# EAGLE board electrotactile_extension (EAGLE 9.4.0), part 1 of 2
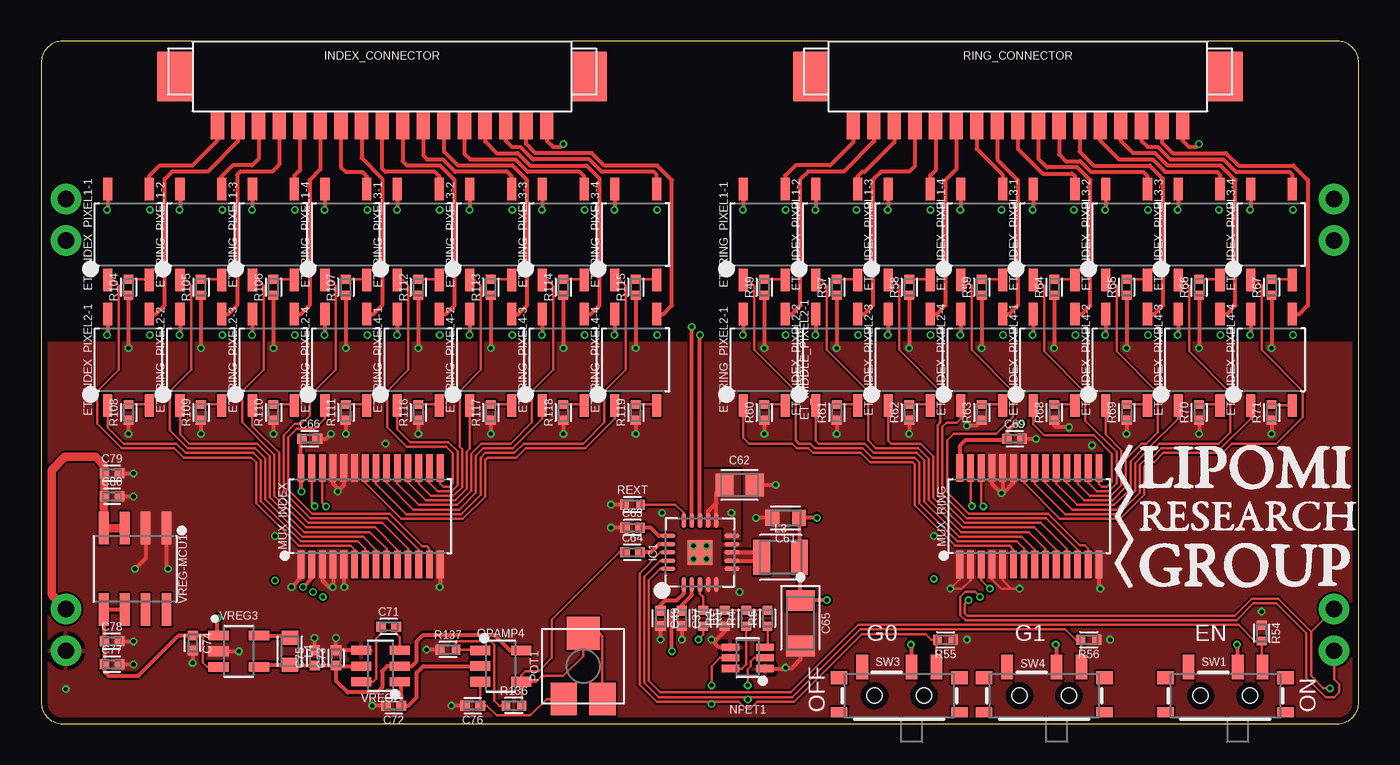
[diagram p6: board, top side]
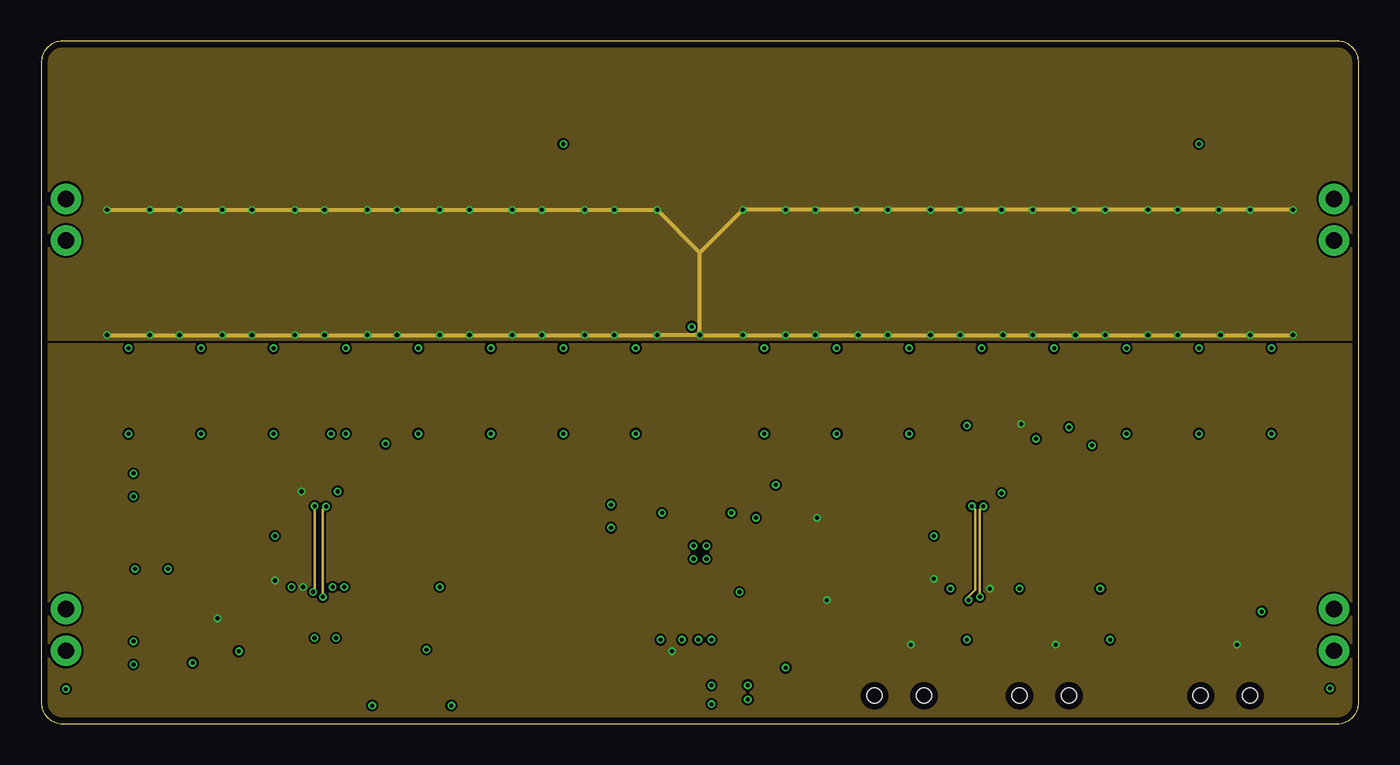
[diagram p7: board, inner layer Route2]
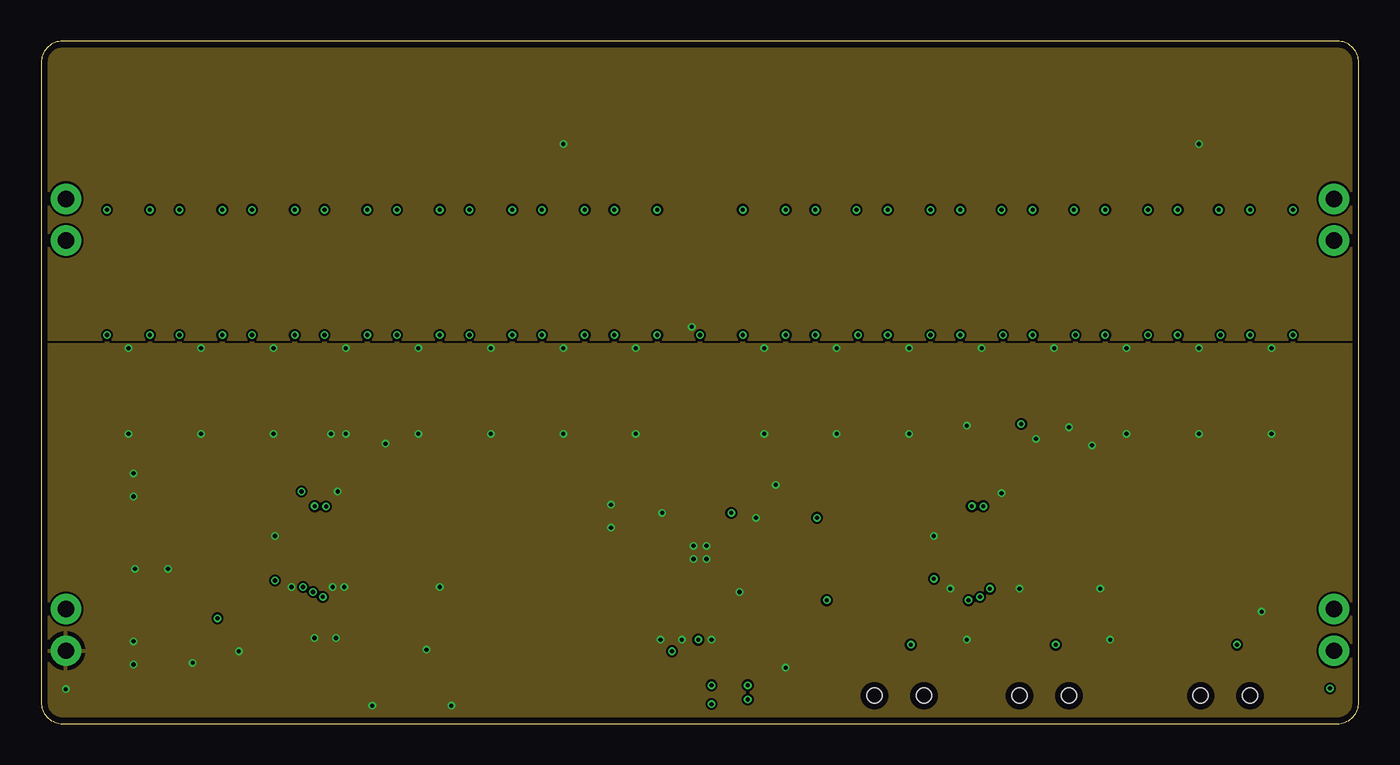
[diagram p8: board, inner layer Route15]
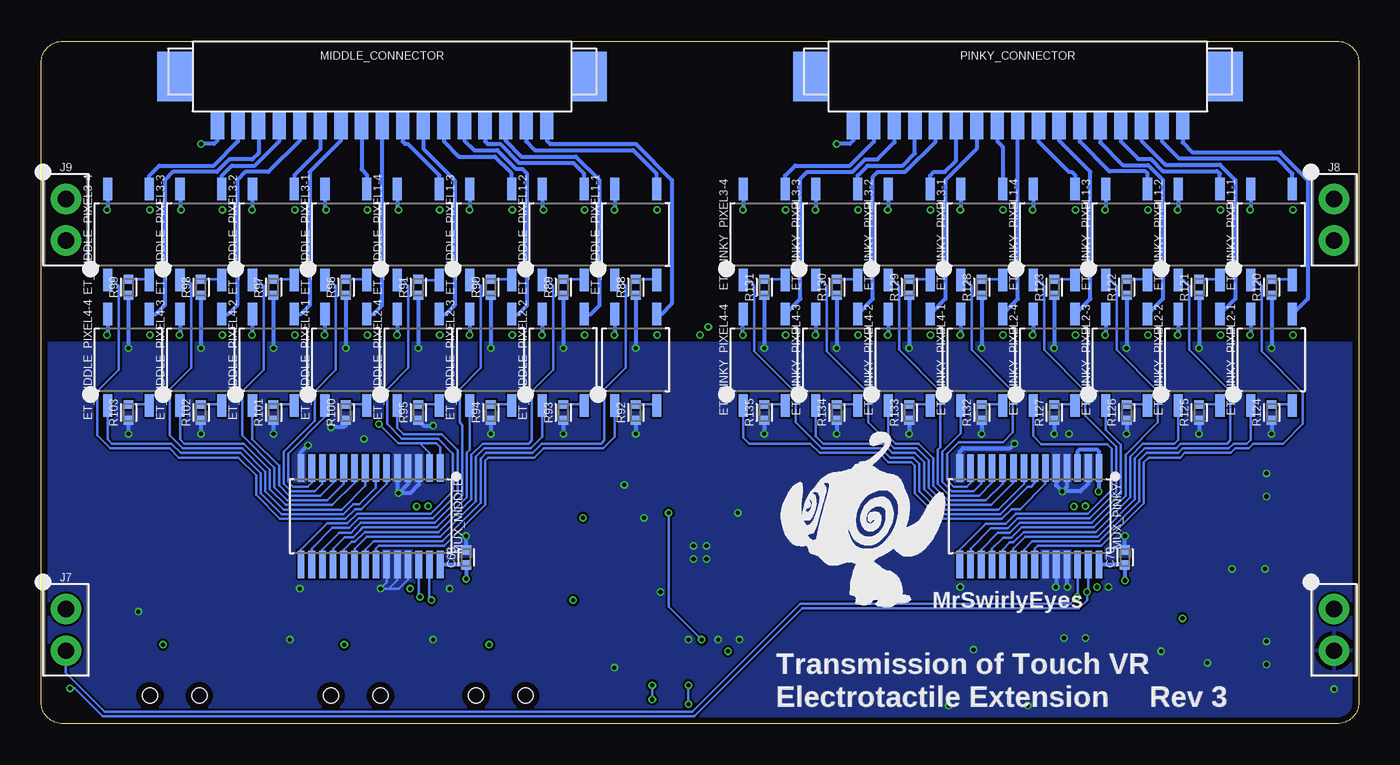
[diagram p9: board, bottom side, seen from below]

Size 80 x 41.44 mm. Coordinates in mm from the lower left corner, seen from the top.
Outline: 78.7,41.44 1.3,41.44 arc90 0,40.14 0,1.3 arc90 1.3,0 78.7,0 arc90 80,1.3 80,40.14 arc90 78.7,41.44
Copper layers (1*2*15*16): Top 0.035559375mm / dielectric 0.17018125mm / Route2 0.01778125mm / dielectric 47mil / Route15 0.01778125mm / dielectric 0.17018125mm / Bottom 0.035559375mm
Design rules "oshpark-4layer": minimum track width 5mil, minimum drill 10mil, track to track 5mil, track to pad 5mil, pad to pad 5mil, via to via 5mil, smd to smd 5mil, copper to edge 15mil, drill to drill 6mil, minimum pad ring 4mil, minimum via ring 4mil, stop-mask expansion 2.5mil, vias tented up to drill 0mil, thermal gap 10mil
Net classes: 1 vcc: width 0.152 mm, drill 0.152 mm, clearance 0.152 mm; 2 RFSIG: width 0.152 mm; 3 ASIG: width 0.152 mm; 4 DGND: width 0.152 mm; 5 NGND: width 0.152 mm

## Footprints (pad centres in the part's own frame; a part is rotated, then mirrored left to right if it is on the bottom)
CAPC1005X55_SMD-0402 = smd 0.585 x 0.612: 1 -0.458,0; 2 0.458,0
CAPC1608X95 = smd 0.846 x 0.97: 1 -0.812,0; 2 0.812,0
CAPC2012X95_SMD-0805 = smd 1.065 x 1.379: 1 -0.925,0; 2 0.925,0
CAPCP3216X160 = smd 1.262 x 1.712: A -1.375,0; K 1.375,0
SOP254P609X203-4 = smd 1.371 x 0.553: 1 -2.768,1.27; 2 -2.768,-1.27; 3 2.768,-1.27; 4 2.768,1.27
QFN50P400X400X100-21T270 = smd 0.896 x 0.264: 1 -1.937,1; 2 -1.937,0.5; 3 -1.937,0; 4 -1.937,-0.5; 5 -1.937,-1; 11 1.937,-1; 12 1.937,-0.5; 13 1.937,0; 14 1.937,0.5; 15 1.937,1 | smd 0.264 x 0.896: 6 -1,-1.937; 7 -0.5,-1.937; 8 0,-1.937; 9 0.5,-1.937; 10 1,-1.937; 16 1,1.937; 17 0.5,1.937; 18 0,1.937; 19 -0.5,1.937; 20 -1,1.937 | smd 1.5 x 1.5: EP 0,0 | drill 0.254 pad 0.381: P$1 -0.4,0.4; P$2 0.4,0.4; P$3 0.4,-0.4; P$4 -0.4,-0.4
1X17_MOLEX_0532611771_RA_SMD = smd 0.8 x 1.6: 1 -10,-3; 2 -8.75,-3; 3 -7.5,-3; 4 -6.25,-3; 5 -5,-3; 6 -3.75,-3; 7 -2.5,-3; 8 -1.25,-3; 9 0,-3; 10 1.25,-3; 11 2.5,-3; 12 3.75,-3; 13 5,-3; 14 6.25,-3; 15 7.5,-3; 16 8.75,-3; 17 10,-3 | smd 2.1 x 3: P$1 -12.6,0; P$2 12.6,0
HDRVR2W64P254_1X2_558X254X850B = drill 1 pad 1.85: 1 -1.27,0; 2 1.27,0
INDC2520X100 = smd 1.012 x 2.112: 1 -1.15,0; 2 1.15,0
INDC1608X60-0603 = smd 0.859 x 1.015: 1 -0.828,0; 2 0.828,0
SOP65P650X110-28 = smd 1.659 x 0.407: 1 -2.926,4.225; 2 -2.926,3.575; 3 -2.926,2.925; 4 -2.926,2.275; 5 -2.926,1.625; 6 -2.926,0.975; 7 -2.926,0.325; 8 -2.926,-0.325; 9 -2.926,-0.975; 10 -2.926,-1.625; 11 -2.926,-2.275; 12 -2.926,-2.925; 13 -2.926,-3.575; 14 -2.926,-4.225; 15 2.926,-4.225; 16 2.926,-3.575; 17 2.926,-2.925; 18 2.926,-2.275; 19 2.926,-1.625; 20 2.926,-0.975; 21 2.926,-0.325; 22 2.926,0.325; 23 2.926,0.975; 24 2.926,1.625; 25 2.926,2.275; 26 2.926,2.925; 27 2.926,3.575; 28 2.926,4.225
SOT65P230X110-6 = smd 1.056 x 0.439: 1 -1.057,0.65; 2 -1.057,0; 3 -1.057,-0.65; 4 1.057,-0.65; 5 1.057,0; 6 1.057,0.65
SOT95P280X145-5 = smd 1.209 x 0.589: 1 -1.253,0.95; 2 -1.253,0; 3 -1.253,-0.95; 4 1.253,-0.95; 5 1.253,0.95
POTENTIOMETER_SQ-L5-W4.5-H2.3 = smd 1.6 x 2: 1 1.175,-2; 3 -1.175,-2 | smd 2 x 2: 2 0,2
RESC1005X35_SMD-0402 = smd 0.535 x 0.6: 1 -0.482,0; 2 0.482,0
SW_SLIDE_SPDT_RA_SMD_4V_300MA_6.7L-2.6W = smd 1.5 x 0.7: 1 1.75,2.25; 2 1.75,-0.75; 3 1.75,-2.25 | smd 0.6 x 1: NC1 -1,-3.65; NC3 -1,3.65 | smd 0.8 x 1: NC2 1.1,-3.65; NC4 1.1,3.65 | hole 0.9: 0,-1.5; 0,1.5
SOT95P275X100-6 = smd 1.212 x 0.552: 1 -1.175,0.95; 2 -1.175,0; 3 -1.175,-0.95; 4 1.175,-0.95; 5 1.175,0; 6 1.175,0.95
SOT95P280X145-5' = smd 1.253 x 0.589: 1 -1.231,0.95; 2 -1.231,0; 3 -1.231,-0.95; 4 1.231,-0.95; 5 1.231,0.95
SOIC127P600X265-8 = smd 1.968 x 0.599: 1 -2.473,1.905; 2 -2.473,0.635; 3 -2.473,-0.635; 4 -2.473,-1.905; 5 2.473,-1.905; 6 2.473,-0.635; 7 2.473,0.635; 8 2.473,1.905

## Placement (x,y rotation side)
C37  0.1uF/50V  [CAPC1005X55_SMD-0402]  38.9,6.4 270 top
C49  0.1uF/50V  [CAPC1005X55_SMD-0402]  37.6,6.4 270 top
C61  0.1uF/50V  [CAPC1608X95]  45.2,12.5 180 top
C62  0.1uF/250V/0805  [CAPC2012X95_SMD-0805]  42.4,14.5 0 top
C63  0.1uF/50V  [CAPC1005X55_SMD-0402]  35.9,11.9 0 top
C64  0.1uF/50V  [CAPC1005X55_SMD-0402]  35.9,10.4 0 top
C65  100uF/10V  [CAPCP3216X160]  46.1,6.1 270 top
C66  0.1uF/50V  [CAPC1005X55_SMD-0402]  16.3,17.3 0 top
C68  0.1uF/50V  [CAPC1005X55_SMD-0402]  54.2,10.1 90 bottom
C69  0.1uF/50V  [CAPC1005X55_SMD-0402]  59.1,17.3 0 top
C70  0.1uF/50V  [CAPC1005X55_SMD-0402]  14.2,10.1 90 bottom
C71  10uF/6.3V  [CAPC1005X55_SMD-0402]  21.1,5.9 0 top
C72  10uF/6.3V  [CAPC1005X55_SMD-0402]  21.4,1.1 180 top
C73  10uF/6.3V  [CAPC1005X55_SMD-0402]  17.9,4 90 top
C74  4.7uF/10V/0402  [CAPC1005X55_SMD-0402]  9.2,4.9 270 top
C75  10uF/6.3V  [CAPC1005X55_SMD-0402]  16.6,4 90 top
C76  0.1uF/50V  [CAPC1005X55_SMD-0402]  26.2,1.1 180 top
C77  10uF/6.3V  [CAPC1005X55_SMD-0402]  4.3,3.6 0 top
C78  0.1uF/50V  [CAPC1005X55_SMD-0402]  4.3,5 0 top
C79  10uF/6.3V  [CAPC1005X55_SMD-0402]  4.3,15.2 0 top
C80  0.1uF/50V  [CAPC1005X55_SMD-0402]  4.3,13.8 0 top
ET_INDEX_PIXEL1-1  SPST-NO 170mA 250V  [SOP254P609X203-4]  5.3,29.7 90 top
ET_INDEX_PIXEL1-2  SPST-NO 170mA 250V  [SOP254P609X203-4]  9.7,29.7 90 top
ET_INDEX_PIXEL1-3  SPST-NO 170mA 250V  [SOP254P609X203-4]  14.1,29.7 90 top
ET_INDEX_PIXEL1-4  SPST-NO 170mA 250V  [SOP254P609X203-4]  18.5,29.7 90 top
ET_INDEX_PIXEL2-1  SPST-NO 170mA 250V  [SOP254P609X203-4]  5.3,22.1 90 top
ET_INDEX_PIXEL2-2  SPST-NO 170mA 250V  [SOP254P609X203-4]  9.7,22.1 90 top
ET_INDEX_PIXEL2-3  SPST-NO 170mA 250V  [SOP254P609X203-4]  14.1,22.1 90 top
ET_INDEX_PIXEL2-4  SPST-NO 170mA 250V  [SOP254P609X203-4]  18.5,22.1 90 top
ET_INDEX_PIXEL3-1  SPST-NO 170mA 250V  [SOP254P609X203-4]  22.9,29.7 90 top
ET_INDEX_PIXEL3-2  SPST-NO 170mA 250V  [SOP254P609X203-4]  27.3,29.7 90 top
ET_INDEX_PIXEL3-3  SPST-NO 170mA 250V  [SOP254P609X203-4]  31.7,29.7 90 top
ET_INDEX_PIXEL3-4  SPST-NO 170mA 250V  [SOP254P609X203-4]  36.1,29.7 90 top
ET_INDEX_PIXEL4-1  SPST-NO 170mA 250V  [SOP254P609X203-4]  22.9,22.1 90 top
ET_INDEX_PIXEL4-2  SPST-NO 170mA 250V  [SOP254P609X203-4]  27.3,22.1 90 top
ET_INDEX_PIXEL4-3  SPST-NO 170mA 250V  [SOP254P609X203-4]  31.7,22.1 90 top
ET_INDEX_PIXEL4-4  SPST-NO 170mA 250V  [SOP254P609X203-4]  36.1,22.1 90 top
ET_MIDDLE_PIXEL1-1  SPST-NO 170mA 250V  [SOP254P609X203-4]  43.9,29.7 90 bottom
ET_MIDDLE_PIXEL1-2  SPST-NO 170mA 250V  [SOP254P609X203-4]  48.3,29.7 90 bottom
ET_MIDDLE_PIXEL1-3  SPST-NO 170mA 250V  [SOP254P609X203-4]  52.7,29.7 90 bottom
ET_MIDDLE_PIXEL1-4  SPST-NO 170mA 250V  [SOP254P609X203-4]  57.1,29.7 90 bottom
ET_MIDDLE_PIXEL2-1  SPST-NO 170mA 250V  [SOP254P609X203-4]  43.9,22.1 90 bottom
ET_MIDDLE_PIXEL2-2  SPST-NO 170mA 250V  [SOP254P609X203-4]  48.3,22.1 90 bottom
ET_MIDDLE_PIXEL2-3  SPST-NO 170mA 250V  [SOP254P609X203-4]  52.7,22.1 90 bottom
ET_MIDDLE_PIXEL2-4  SPST-NO 170mA 250V  [SOP254P609X203-4]  57.1,22.1 90 bottom
ET_MIDDLE_PIXEL3-1  SPST-NO 170mA 250V  [SOP254P609X203-4]  61.5,29.7 90 bottom
ET_MIDDLE_PIXEL3-2  SPST-NO 170mA 250V  [SOP254P609X203-4]  65.9,29.7 90 bottom
ET_MIDDLE_PIXEL3-3  SPST-NO 170mA 250V  [SOP254P609X203-4]  70.3,29.7 90 bottom
ET_MIDDLE_PIXEL3-4  SPST-NO 170mA 250V  [SOP254P609X203-4]  74.7,29.7 90 bottom
ET_MIDDLE_PIXEL4-1  SPST-NO 170mA 250V  [SOP254P609X203-4]  61.5,22.1 90 bottom
ET_MIDDLE_PIXEL4-2  SPST-NO 170mA 250V  [SOP254P609X203-4]  65.9,22.1 90 bottom
ET_MIDDLE_PIXEL4-3  SPST-NO 170mA 250V  [SOP254P609X203-4]  70.3,22.1 90 bottom
ET_MIDDLE_PIXEL4-4  SPST-NO 170mA 250V  [SOP254P609X203-4]  74.7,22.1 90 bottom
ET_PINKY_PIXEL1-1  SPST-NO 170mA 250V  [SOP254P609X203-4]  5.3,29.7 90 bottom
ET_PINKY_PIXEL1-2  SPST-NO 170mA 250V  [SOP254P609X203-4]  9.7,29.7 90 bottom
ET_PINKY_PIXEL1-3  SPST-NO 170mA 250V  [SOP254P609X203-4]  14.1,29.7 90 bottom
ET_PINKY_PIXEL1-4  SPST-NO 170mA 250V  [SOP254P609X203-4]  18.5,29.7 90 bottom
ET_PINKY_PIXEL2-1  SPST-NO 170mA 250V  [SOP254P609X203-4]  5.3,22.1 90 bottom
ET_PINKY_PIXEL2-2  SPST-NO 170mA 250V  [SOP254P609X203-4]  9.7,22.1 90 bottom
ET_PINKY_PIXEL2-3  SPST-NO 170mA 250V  [SOP254P609X203-4]  14.1,22.1 90 bottom
ET_PINKY_PIXEL2-4  SPST-NO 170mA 250V  [SOP254P609X203-4]  18.5,22.1 90 bottom
ET_PINKY_PIXEL3-1  SPST-NO 170mA 250V  [SOP254P609X203-4]  22.9,29.7 90 bottom
ET_PINKY_PIXEL3-2  SPST-NO 170mA 250V  [SOP254P609X203-4]  27.3,29.7 90 bottom
ET_PINKY_PIXEL3-3  SPST-NO 170mA 250V  [SOP254P609X203-4]  31.7,29.7 90 bottom
ET_PINKY_PIXEL3-4  SPST-NO 170mA 250V  [SOP254P609X203-4]  36.1,29.7 90 bottom
ET_PINKY_PIXEL4-1  SPST-NO 170mA 250V  [SOP254P609X203-4]  22.9,22.1 90 bottom
ET_PINKY_PIXEL4-2  SPST-NO 170mA 250V  [SOP254P609X203-4]  27.3,22.1 90 bottom
ET_PINKY_PIXEL4-3  SPST-NO 170mA 250V  [SOP254P609X203-4]  31.7,22.1 90 bottom
ET_PINKY_PIXEL4-4  SPST-NO 170mA 250V  [SOP254P609X203-4]  36.1,22.1 90 bottom
ET_RING_PIXEL1-1  SPST-NO 170mA 250V  [SOP254P609X203-4]  43.9,29.7 90 top
ET_RING_PIXEL1-2  SPST-NO 170mA 250V  [SOP254P609X203-4]  48.3,29.7 90 top
ET_RING_PIXEL1-3  SPST-NO 170mA 250V  [SOP254P609X203-4]  52.7,29.7 90 top
ET_RING_PIXEL1-4  SPST-NO 170mA 250V  [SOP254P609X203-4]  57.1,29.7 90 top
ET_RING_PIXEL2-1  SPST-NO 170mA 250V  [SOP254P609X203-4]  43.9,22.1 90 top
ET_RING_PIXEL2-2  SPST-NO 170mA 250V  [SOP254P609X203-4]  48.3,22.1 90 top
ET_RING_PIXEL2-3  SPST-NO 170mA 250V  [SOP254P609X203-4]  52.7,22.1 90 top
ET_RING_PIXEL2-4  SPST-NO 170mA 250V  [SOP254P609X203-4]  57.1,22.1 90 top
ET_RING_PIXEL3-1  SPST-NO 170mA 250V  [SOP254P609X203-4]  61.5,29.7 90 top
ET_RING_PIXEL3-2  SPST-NO 170mA 250V  [SOP254P609X203-4]  65.9,29.7 90 top
ET_RING_PIXEL3-3  SPST-NO 170mA 250V  [SOP254P609X203-4]  70.3,29.7 90 top
ET_RING_PIXEL3-4  SPST-NO 170mA 250V  [SOP254P609X203-4]  74.7,29.7 90 top
ET_RING_PIXEL4-1  SPST-NO 170mA 250V  [SOP254P609X203-4]  61.5,22.1 90 top
ET_RING_PIXEL4-2  SPST-NO 170mA 250V  [SOP254P609X203-4]  65.9,22.1 90 top
ET_RING_PIXEL4-3  SPST-NO 170mA 250V  [SOP254P609X203-4]  70.3,22.1 90 top
ET_RING_PIXEL4-4  SPST-NO 170mA 250V  [SOP254P609X203-4]  74.7,22.1 90 top
IC1  DRV8662  [QFN50P400X400X100-21T270]  40,10.4 90 top
INDEX_CONNECTOR  1x17 MOLEX SMD RA  [1X17_MOLEX_0532611771_RA_SMD]  20.7,39.3 0 top
J6  1x02 PTH VERT FEMALE  [HDRVR2W64P254_1X2_558X254X850B]  1.5,5.7 270 bottom
J7  1x02 PTH VERT FEMALE  [HDRVR2W64P254_1X2_558X254X850B]  78.5,5.7 270 bottom
J8  1x02 PTH VERT FEMALE  [HDRVR2W64P254_1X2_558X254X850B]  1.5,30.6 270 bottom
J9  1x02 PTH VERT FEMALE  [HDRVR2W64P254_1X2_558X254X850B]  78.5,30.6 270 bottom
L3  4.7uH/2A/1008  [INDC2520X100]  44.9,10.1 0 top
L4  10uH/380mA  [INDC1608X60-0603]  15.1,4.4 270 top
MIDDLE_CONNECTOR  1x17 MOLEX SMD RA  [1X17_MOLEX_0532611771_RA_SMD]  59.3,39.3 0 bottom
MUX_INDEX  PCA9685  [SOP65P650X110-28]  20,12.6 90 top
MUX_MIDDLE  PCA9685  [SOP65P650X110-28]  60,12.6 270 bottom
MUX_PINKY  PCA9685  [SOP65P650X110-28]  20,12.6 270 bottom
MUX_RING  PCA9685  [SOP65P650X110-28]  60,12.6 90 top
NFET1  2N7002DW  [SOT65P230X110-6]  42.9,4 180 top
OPAMP4  TLV2361_GP_20MA_7MHZ  [SOT95P280X145-5]  27.9,3.5 0 top
PINKY_CONNECTOR  1x17 MOLEX SMD RA  [1X17_MOLEX_0532611771_RA_SMD]  20.7,39.3 0 bottom
POT1  100K  [POTENTIOMETER_SQ-L5-W4.5-H2.3]  32.9,3.5 0 top
R1  768K  [RESC1005X35_SMD-0402]  40.2,6.4 270 top
R2  115K  [RESC1005X35_SMD-0402]  41.5,6.4 90 top
R4  220K  [RESC1005X35_SMD-0402]  42.8,6.4 90 top
R5  100K  [RESC1005X35_SMD-0402]  44.1,6.4 90 top
R49  1K  [RESC1005X35_SMD-0402]  5.3,26.5 90 top
R54  10K  [RESC1005X35_SMD-0402]  74.1,5.5 270 top
R55  10K  [RESC1005X35_SMD-0402]  54.9,5.1 180 top
R56  10K  [RESC1005X35_SMD-0402]  63.6,5.1 180 top
R57  1K  [RESC1005X35_SMD-0402]  9.7,26.5 90 top
R58  1K  [RESC1005X35_SMD-0402]  14.1,26.5 90 top
R59  1K  [RESC1005X35_SMD-0402]  18.5,26.5 90 top
R60  1K  [RESC1005X35_SMD-0402]  5.3,18.9 90 top
R61  1K  [RESC1005X35_SMD-0402]  9.7,18.9 90 top
R62  1K  [RESC1005X35_SMD-0402]  14.1,18.9 90 top
R63  1K  [RESC1005X35_SMD-0402]  18.5,18.9 90 top
R64  1K  [RESC1005X35_SMD-0402]  22.9,26.5 90 top
R65  1K  [RESC1005X35_SMD-0402]  27.3,26.5 90 top
R66  1K  [RESC1005X35_SMD-0402]  31.7,26.5 90 top
R67  1K  [RESC1005X35_SMD-0402]  36.1,26.5 90 top
R68  1K  [RESC1005X35_SMD-0402]  22.9,18.9 90 top
R69  1K  [RESC1005X35_SMD-0402]  27.3,18.9 90 top
R70  1K  [RESC1005X35_SMD-0402]  31.7,18.9 90 top
R71  1K  [RESC1005X35_SMD-0402]  36.1,18.9 90 top
R88  1K  [RESC1005X35_SMD-0402]  43.9,26.5 90 bottom
R89  1K  [RESC1005X35_SMD-0402]  48.3,26.5 90 bottom
R90  1K  [RESC1005X35_SMD-0402]  52.7,26.5 90 bottom
R91  1K  [RESC1005X35_SMD-0402]  57.1,26.5 90 bottom
R92  1K  [RESC1005X35_SMD-0402]  43.9,18.9 90 bottom
R93  1K  [RESC1005X35_SMD-0402]  48.3,18.9 90 bottom
R94  1K  [RESC1005X35_SMD-0402]  52.7,18.9 90 bottom
R95  1K  [RESC1005X35_SMD-0402]  57.1,18.9 90 bottom
R96  1K  [RESC1005X35_SMD-0402]  61.5,26.5 90 bottom
R97  1K  [RESC1005X35_SMD-0402]  65.9,26.5 90 bottom
R98  1K  [RESC1005X35_SMD-0402]  70.3,26.5 90 bottom
R99  1K  [RESC1005X35_SMD-0402]  74.7,26.5 90 bottom
R100  1K  [RESC1005X35_SMD-0402]  61.5,18.9 90 bottom
R101  1K  [RESC1005X35_SMD-0402]  65.9,18.9 90 bottom
R102  1K  [RESC1005X35_SMD-0402]  70.3,18.9 90 bottom
R103  1K  [RESC1005X35_SMD-0402]  74.7,18.9 90 bottom
R104  1K  [RESC1005X35_SMD-0402]  43.9,26.5 90 top
R105  1K  [RESC1005X35_SMD-0402]  48.3,26.5 90 top
R106  1K  [RESC1005X35_SMD-0402]  52.7,26.5 90 top
R107  1K  [RESC1005X35_SMD-0402]  57.1,26.5 90 top
R108  1K  [RESC1005X35_SMD-0402]  43.9,18.9 90 top
R109  1K  [RESC1005X35_SMD-0402]  48.3,18.9 90 top
R110  1K  [RESC1005X35_SMD-0402]  52.7,18.9 90 top
R111  1K  [RESC1005X35_SMD-0402]  57.1,18.9 90 top
R112  1K  [RESC1005X35_SMD-0402]  61.5,26.5 90 top
R113  1K  [RESC1005X35_SMD-0402]  65.9,26.5 90 top
R114  1K  [RESC1005X35_SMD-0402]  70.3,26.5 90 top
R115  1K  [RESC1005X35_SMD-0402]  74.7,26.5 90 top
R116  1K  [RESC1005X35_SMD-0402]  61.5,18.9 90 top
R117  1K  [RESC1005X35_SMD-0402]  65.9,18.9 90 top
R118  1K  [RESC1005X35_SMD-0402]  70.3,18.9 90 top
R119  1K  [RESC1005X35_SMD-0402]  74.7,18.9 90 top
R120  1K  [RESC1005X35_SMD-0402]  5.3,26.5 90 bottom
R121  1K  [RESC1005X35_SMD-0402]  9.7,26.5 90 bottom
R122  1K  [RESC1005X35_SMD-0402]  14.1,26.5 90 bottom
R123  1K  [RESC1005X35_SMD-0402]  18.5,26.5 90 bottom
R124  1K  [RESC1005X35_SMD-0402]  5.3,18.9 90 bottom
R125  1K  [RESC1005X35_SMD-0402]  9.7,18.9 90 bottom
R126  1K  [RESC1005X35_SMD-0402]  14.1,18.9 90 bottom
R127  1K  [RESC1005X35_SMD-0402]  18.5,18.9 90 bottom
R128  1K  [RESC1005X35_SMD-0402]  22.9,26.5 90 bottom
R129  1K  [RESC1005X35_SMD-0402]  27.3,26.5 90 bottom
R130  1K  [RESC1005X35_SMD-0402]  31.7,26.5 90 bottom
R131  1K  [RESC1005X35_SMD-0402]  36.1,26.5 90 bottom
R132  1K  [RESC1005X35_SMD-0402]  22.9,18.9 90 bottom
R133  1K  [RESC1005X35_SMD-0402]  27.3,18.9 90 bottom
R134  1K  [RESC1005X35_SMD-0402]  31.7,18.9 90 bottom
R135  1K  [RESC1005X35_SMD-0402]  36.1,18.9 90 bottom
R136  10K  [RESC1005X35_SMD-0402]  28.7,1.1 0 top
R137  10K  [RESC1005X35_SMD-0402]  24.7,4.5 0 top
REXT  7.5K  [RESC1005X35_SMD-0402]  35.9,13.3 0 top
RING_CONNECTOR  1x17 MOLEX SMD RA  [1X17_MOLEX_0532611771_RA_SMD]  59.3,39.3 0 top
SW1  300mA/4V  [SW_SLIDE_SPDT_RA_SMD_4V_300MA_6.7L-2.6W]  71.9,1.7 90 top
SW3  300mA/4V  [SW_SLIDE_SPDT_RA_SMD_4V_300MA_6.7L-2.6W]  52.1,1.7 90 top
SW4  300mA/4V  [SW_SLIDE_SPDT_RA_SMD_4V_300MA_6.7L-2.6W]  60.9,1.7 90 top
U$1  [LRG-LOGO-2]  72.5,12.6 0 top
U$2  [MRSWIRLYEYES-LOGO]  30.1,12.4 0 bottom
VREG2  NCP1729 50mA  [SOT95P275X100-6]  20.6,3.5 180 top
VREG3  TPS62202 300mA 1.8V  [SOT95P280X145-5']  12,4.4 0 top
VREG-MCU1  TPS76833QDR 1A/3.3V  [SOIC127P600X265-8]  5.7,9.4 270 top